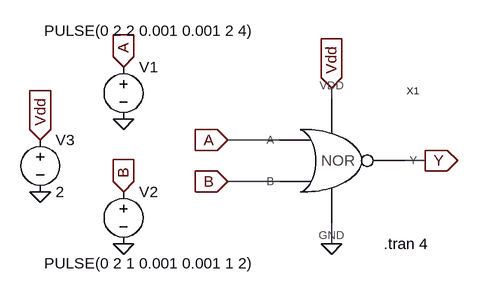
[diagram p0: schematic NOR_SYM_TESTING.asc]
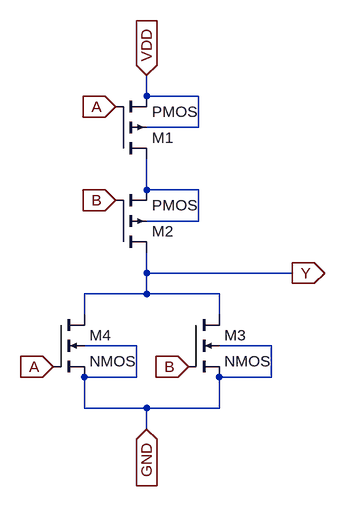
[diagram p1: sub-circuit nor_sym.asc]
NOR_SYM_TESTING.asc, the LTspice schematic file:
Version 4
SHEET 1 880 680
WIRE 336 144 336 128
WIRE 256 208 176 208
WIRE 480 240 448 240
WIRE 256 272 176 272
WIRE 336 368 336 336
FLAG 176 208 A
IOPIN 176 208 In
FLAG 176 272 B
IOPIN 176 272 In
FLAG -112 208 Vdd
IOPIN -112 208 In
FLAG 16 96 A
IOPIN 16 96 In
FLAG 16 288 B
IOPIN 16 288 In
FLAG 16 176 0
FLAG -112 288 0
FLAG 16 368 0
FLAG 336 368 0
FLAG 336 128 Vdd
IOPIN 336 128 In
FLAG 480 240 Y
IOPIN 480 240 Out
SYMBOL voltage 16 80 R0
WINDOW 3 -122 -40 Left 2
WINDOW 123 0 0 Left 0
WINDOW 39 0 0 Left 0
SYMATTR Value PULSE(0 2 2 0.001 0.001 2 4)
SYMATTR InstName V1
SYMBOL voltage 16 272 R0
WINDOW 3 -122 126 Left 2
WINDOW 123 0 0 Left 0
WINDOW 39 0 0 Left 0
SYMATTR Value PULSE(0 2 1 0.001 0.001 1 2)
SYMATTR InstName V2
SYMBOL voltage -112 192 R0
WINDOW 123 0 0 Left 0
WINDOW 39 0 0 Left 0
SYMATTR InstName V3
SYMATTR Value 2
SYMBOL NOR_SYM 352 240 R0
SYMATTR InstName X1
TEXT 416 368 Left 2 !.tran 4

nor_sym.asc, the sub-circuit schematic file:
Version 4
SHEET 1 880 680
WIRE -192 -208 -192 -240
WIRE -112 -208 -192 -208
WIRE -112 -160 -112 -208
WIRE -112 -160 -192 -160
WIRE -192 -64 -192 -112
WIRE -112 -64 -192 -64
WIRE -112 -16 -112 -64
WIRE -112 -16 -192 -16
WIRE -192 64 -192 32
WIRE 32 64 -192 64
WIRE -192 96 -192 64
WIRE -192 96 -288 96
WIRE -80 96 -192 96
WIRE -288 128 -288 96
WIRE -80 128 -80 96
WIRE -208 176 -288 176
WIRE 0 176 -80 176
WIRE -208 224 -208 176
WIRE -208 224 -288 224
WIRE 0 224 0 176
WIRE 0 224 -80 224
WIRE -288 272 -288 224
WIRE -192 272 -288 272
WIRE -80 272 -80 224
WIRE -80 272 -192 272
WIRE -192 304 -192 272
FLAG -192 -240 VDD
IOPIN -192 -240 In
FLAG -192 304 GND
IOPIN -192 304 In
FLAG -336 208 A
IOPIN -336 208 In
FLAG -128 208 B
IOPIN -128 208 In
FLAG -240 -192 A
IOPIN -240 -192 In
FLAG -240 -48 B
IOPIN -240 -48 In
FLAG 32 64 Y
IOPIN 32 64 Out
SYMBOL pmos4 -240 -112 M180
SYMATTR InstName M1
SYMBOL pmos4 -240 32 M180
SYMATTR InstName M2
SYMBOL nmos4 -128 128 R0
SYMATTR InstName M3
SYMBOL nmos4 -336 128 R0
SYMATTR InstName M4

The netlist it stands for:
* NOR_SYM_TESTING.asc
V1 A 0 PULSE(0 2 2 0.001 0.001 2 4)
V2 B 0 PULSE(0 2 1 0.001 0.001 1 2)
V3 Vdd 0 2
XX1 A B Y Vdd 0 nor_sym

* block symbol definitions
.subckt nor_sym A B Y VDD GND
M1 N001 A VDD VDD PMOS
M2 Y B N001 N001 PMOS
M3 Y B GND GND NMOS
M4 Y A GND GND NMOS
.ends nor_sym

.model NMOS NMOS
.model PMOS PMOS
.lib standard.mos
.tran 4
.backanno
.end